# Altium schematic sheet Encoder_USBC.SchDoc: STM32F446 CNC
size B; Author: AM; CompanyName: Expatria Technologies; DrawnBy: A.Marles; Engineer: AM; Organization: Expatria Technolgoies; DocumentNumber: 11; Revision: A1; SheetNumber: 11; SheetTotal: 14
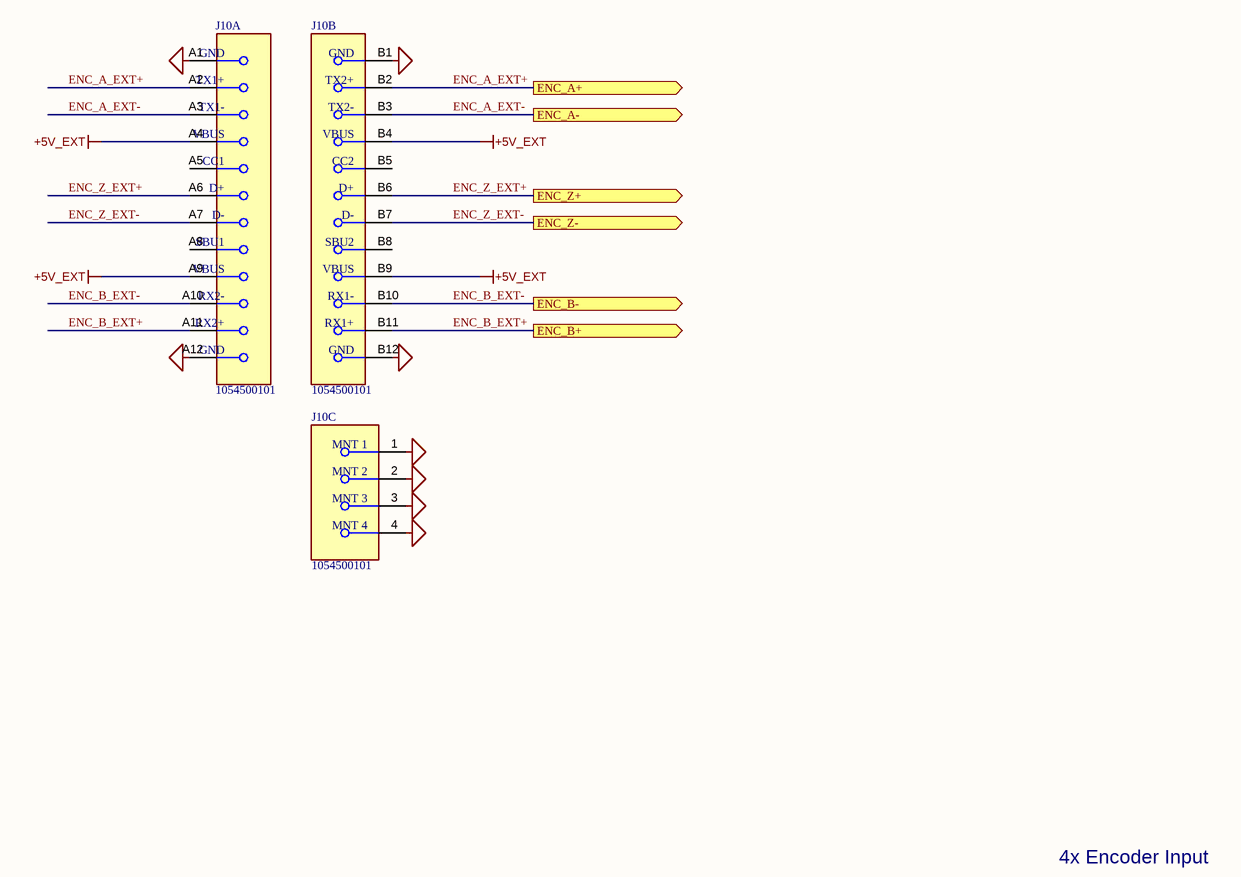
[diagram p0: Encoder_USBC.SchDoc]

## Parts
J10  1054500101  [FP-1054500101-MFG]  (parts A,B,C of 3)

## Ports
ENC_A+ (out), ENC_A- (out), ENC_B+ (out), ENC_B- (out), ENC_Z+ (out), ENC_Z- (out)

## Nets
+5V_EXT: J10.A4(VBUS) J10.A9(VBUS) J10.B4(VBUS) J10.B9(VBUS)
GND_EXT: J10.1(MNT_1) J10.2(MNT_2) J10.3(MNT_3) J10.4(MNT_4) J10.A1(GND) J10.A12(GND) J10.B1(GND) J10.B12(GND)
ENC_A_EXT+: J10.A2(TX1+) J10.B2(TX2+) ; port ENC_A+
ENC_A_EXT-: J10.A3(TX1-) J10.B3(TX2-) ; port ENC_A-
ENC_B_EXT+: J10.A11(RX2+) J10.B11(RX1+) ; port ENC_B+
ENC_B_EXT-: J10.A10(RX2-) J10.B10(RX1-) ; port ENC_B-
ENC_Z_EXT+: J10.A6(D+) J10.B6(D+) ; port ENC_Z+
ENC_Z_EXT-: J10.A7(D-) J10.B7(D-) ; port ENC_Z-

Not connected (* = marked no-connect by the designer): J10 A5(CC1) A8(SBU1) B5(CC2) B8(SBU2)

## Notes on the sheet
- 4x Encoder Input
- SHEET
- Expatria Technologies
- 1136 Glade Court
- Port Coquitlam, BC V3B 1R5
- PROJECT
- SIZE
- ENGR
- MODIFIED
- DOCUMENT
- REV
- Copyright Expatria Technologies 2022. This document describes Open Hardware and is licensed under the CERN-OHL-S v2. No warranty is implied or expressed.
- EMAIL: INFO@EXPATRIA.CA
- B
- /

## Library data of the parts
J10 = MOLEX-USBC: CONN RCP USB3.1 TYPEC 24P SMD RA; Manufacturer: Molex; Number Of Contacts: 24; Voltage Rating: 30V; Shielding: true; Is Female: yes; Current Rating: 0.25/1.25/5A; Pitch: 0.5mm; Conn Orientation: Right Angle; Package: 0; Height: 3.44mm; Footprint Url: https://www.molex.com/pdm_docs/sd/1054500101_sd.pdf; Device Class L1: Connectors; Category: Conn; Device Class L2: USB Connectors; Digikey Description: CONN RCP USB3.1 TYPEC 24P SMD RA; Contact Material: Gold,Nickel; Mouser Description: USB Shielded I/O Receptacle; Type C; Right Angle; Surface Mount; Gold over Nickel; ComponentLink2Description: Datasheet; Lead Free: Yes; Automotive: No; Temperature Range High: +85°C; RoHS: TRUE; Octopart: https://octopart.com/105450-0101-molex-68082325; ComponentLink2URL: https://www.molex.com/webdocs/datasheets/pdf/en-us/1054500101_IO_CONNECTORS.pdf; Temperature: -30°C to +85°C; Usb Standard: USB 3.1; Temperature Range Low: -30°C; Device Class L3: unset; Manufacturer Part Number: 1054500101; SuppliersPartNumber: C134092